# Altium schematic sheet ports.SchDoc
size A4
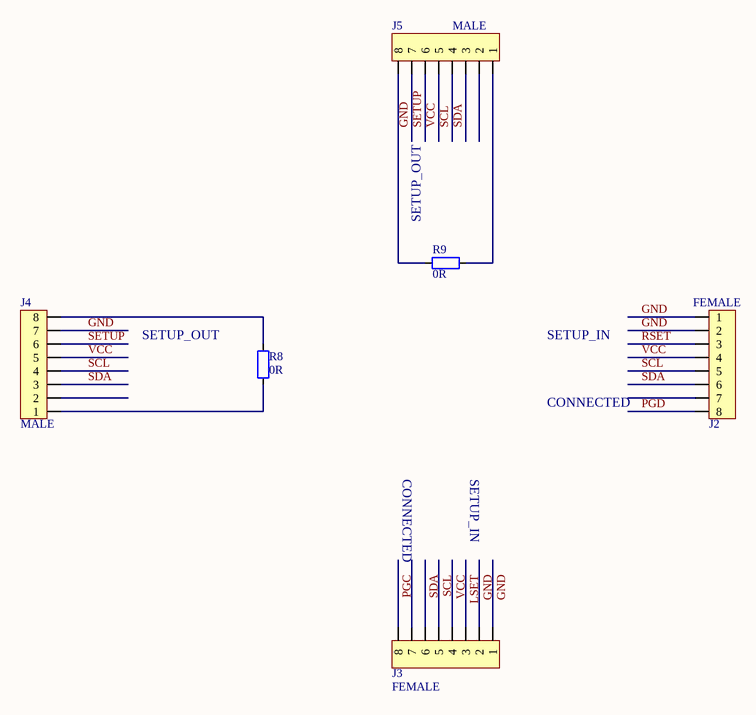
[diagram p0: ports.SchDoc]

## Parts
J2  FEMALE  [HDR1X10_2.54_180H]
J3  FEMALE  [HDR1X10_2.54_180H]
J4  MALE  [HDR1X10_2.54_180H]
J5  MALE  [HDR1X10_2.54_180H]
R8  value 0R  [RES_0603]  (hidden comment: Res_0603)
R9  value 0R  [RES_0603]  (hidden comment: Res_0603)

## Nets
GND: J2.1 J2.2 J3.1 J3.2 J4.7 J5.7
LSET: J3.3
PGC: J3.8
PGD: J2.8
RSET: J2.3
SCL: J2.5 J3.5 J4.4 J5.4
SDA: J2.6 J3.6 J4.3 J5.3
SETUP: J4.6 J5.6
VCC: J2.4 J3.4 J4.5 J5.5
NetJ4_1: J4.1 R8.1
NetJ4_8: J4.8 R8.2
NetJ5_1: J5.1 R9.2
NetJ5_8: J5.8 R9.1

Not connected (* = marked no-connect by the designer): J2 7; J3 7; J4 2; J5 2

## Notes on the sheet
- (near R9) SETUP_OUT
- SETUP_OUT
- SETUP_IN
- CONNECTED

## Library data of the parts
J2-J5 = HDR1x8_2.54T: Header
R8 R9 = Res_0603: Resistor